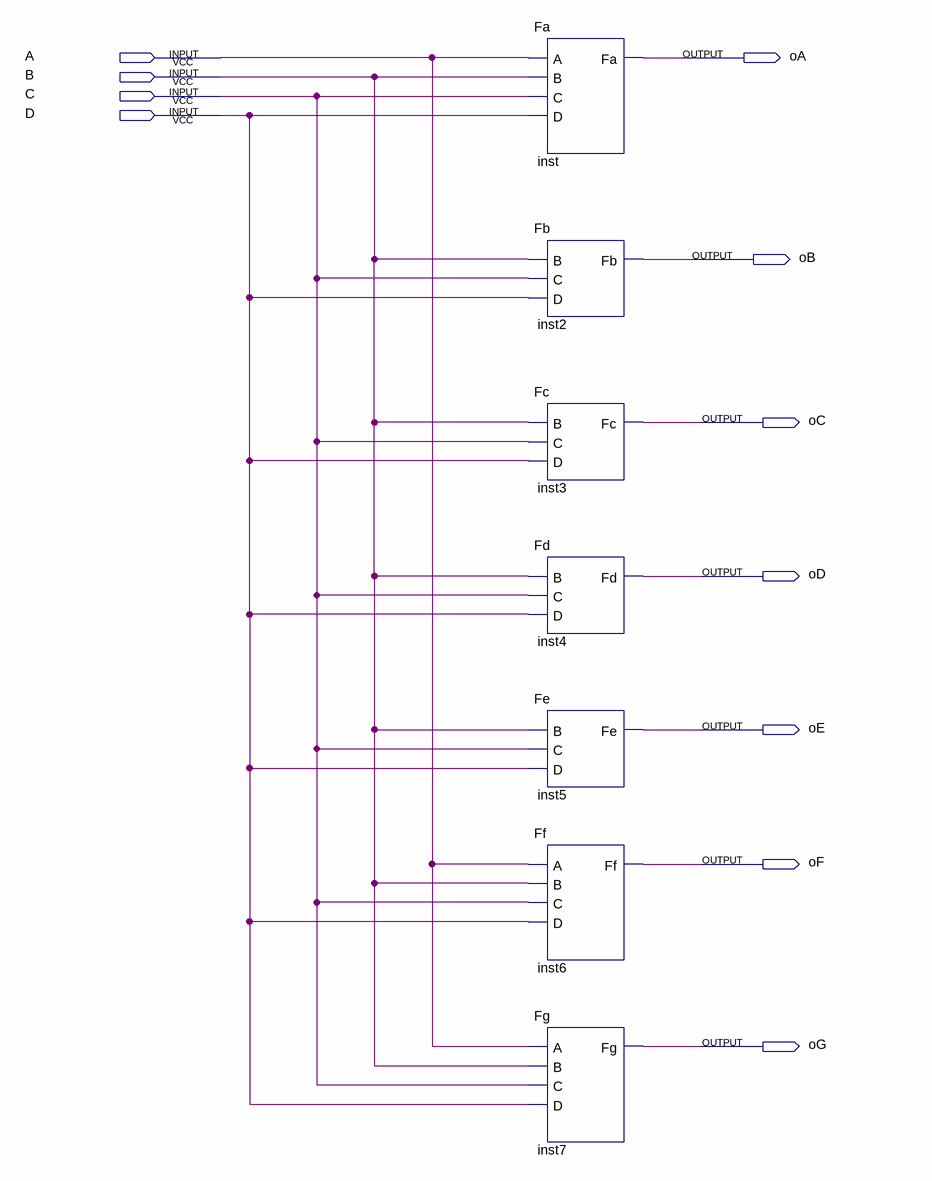
[diagram p0: schematic sheet]
// Quartus schematic display.bdf as structural Verilog: 7 symbols, 11 pins
module display (
  input  A,
  input  B,
  input  C,
  input  D,
  output oA,
  output oB,
  output oC,
  output oD,
  output oE,
  output oF,
  output oG
);

  Fa inst (.A(A), .B(B), .C(C), .D(D), .Fa(oA));
  Fb inst2 (.B(B), .C(C), .D(D), .Fb(oB));
  Fc inst3 (.B(B), .C(C), .D(D), .Fc(oC));
  Fd inst4 (.B(B), .C(C), .D(D), .Fd(oD));
  Fe inst5 (.B(B), .C(C), .D(D), .Fe(oE));
  Ff inst6 (.A(A), .B(B), .C(C), .D(D), .Ff(oF));
  Fg inst7 (.A(A), .B(B), .C(C), .D(D), .Fg(oG));
endmodule
